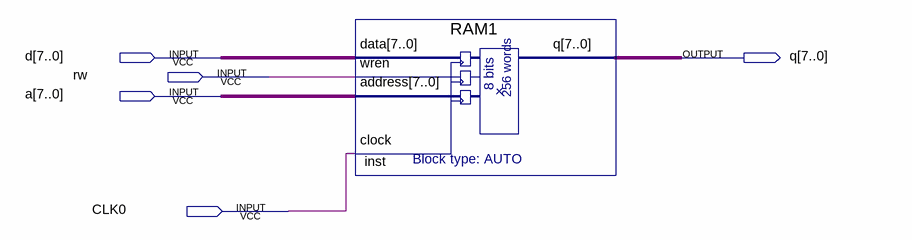
[diagram p0: schematic sheet]
// Quartus schematic exp2_2.bdf as structural Verilog: 1 symbols, 5 pins
module exp2_2 (
  input  [7:0] d,
  input  rw,
  input  [7:0] a,
  input  CLK0,
  output [7:0] q
);

  RAM1 inst (.data(d), .wren(rw), .address(a), .clock(CLK0), .q(q));
endmodule
